# EAGLE schematic lm324ecg (EAGLE 8.5.1)
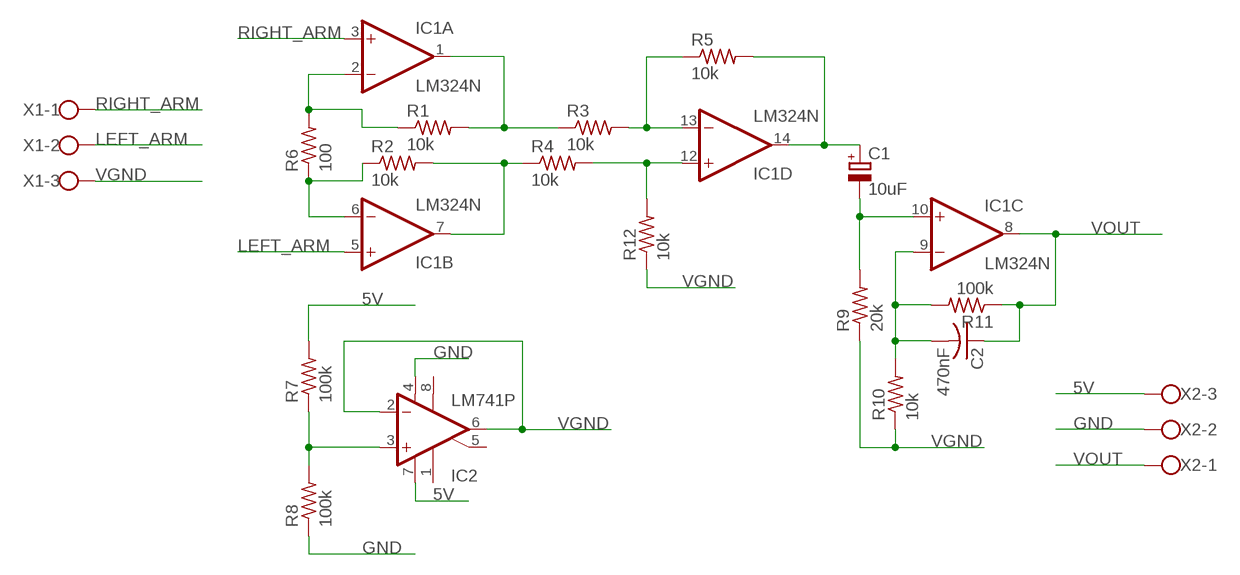
[diagram p0: schematic, sheet 1]

## Parts
C1  10uF  CPOL-EUE2.5-7  [E2,5-7]
C2  470nF  C-US050-035X075  [C050-035X075]
IC1  LM324N  [DIL14]
IC2  LM741P  [DIL08]
R1  10k  R-US_0207/10  [0207/10]
R2  10k  R-US_0207/10  [0207/10]
R3  10k  R-US_0207/10  [0207/10]
R4  10k  R-US_0207/10  [0207/10]
R5  10k  R-US_0207/10  [0207/10]
R6  100  R-US_0207/10  [0207/10]
R7  100k  R-US_0207/10  [0207/10]
R8  100k  R-US_0207/10  [0207/10]
R9  20k  R-US_0207/10  [0207/10]
R10  10k  R-US_0207/10  [0207/10]
R11  100k  R-US_0207/10  [0207/10]
R12  10k  R-US_0207/10  [0207/10]
X1  W237-103  [W237-103]
X2  W237-103  [W237-103]

## Nets
5V: IC2.7(V+) R7.2 X2.3
GND: IC2.4(V-) R8.1 X2.2
LEFT_ARM: IC1.5(B:+IN) X1.2
N$1: IC1.2(A:-IN) R1.1 R6.2
N$2: IC1.6(B:-IN) R2.1 R6.1
N$3: IC1.7(B:OUT) R2.2 R4.1
N$5: IC1.1(A:OUT) R1.2 R3.1
N$7: IC1.13(D:-IN) R3.2 R5.1
N$8: IC1.12(D:+IN) R4.2 R12.2
N$9: C1.+ IC1.14(D:OUT) R5.2
N$13: C1.- IC1.10(C:+IN) R9.2
N$14: C2.2 IC1.9(C:-IN) R10.2 R11.2
N$17: IC2.3(+IN) R7.1 R8.2
RIGHT_ARM: IC1.3(A:+IN) X1.1
VGND: IC2.2(-IN) IC2.6(OUT) R9.1 R10.1 R12.1 X1.3
VOUT: C2.1 IC1.8(C:OUT) R11.1 X2.1
Unconnected: IC2.1(ON1) IC2.5(ON2) IC2.8(OPT)

## Power pins joined to a net without a drawn wire
V+: IC1.4(P:V+)
V-: IC1.11(P:V-)

## Library data of the parts
C1 = rcl:CPOL-EU: POLARIZED CAPACITOR, European symbol; SPICEPREFIX: C
C2 = rcl:C-US: CAPACITOR, American symbol; SPICEPREFIX: C
IC1 = linear:LM324: OP AMP
IC2 = linear:*741: OP AMP
R1-R12 = rcl:R-US_: RESISTOR, American symbol; SPICEPREFIX: R
X1 X2 = con-wago-500:W237-103: WAGO SCREW CLAMP; MPN: 237-103; OC_FARNELL: unknown; OC_NEWARK: 18M7116